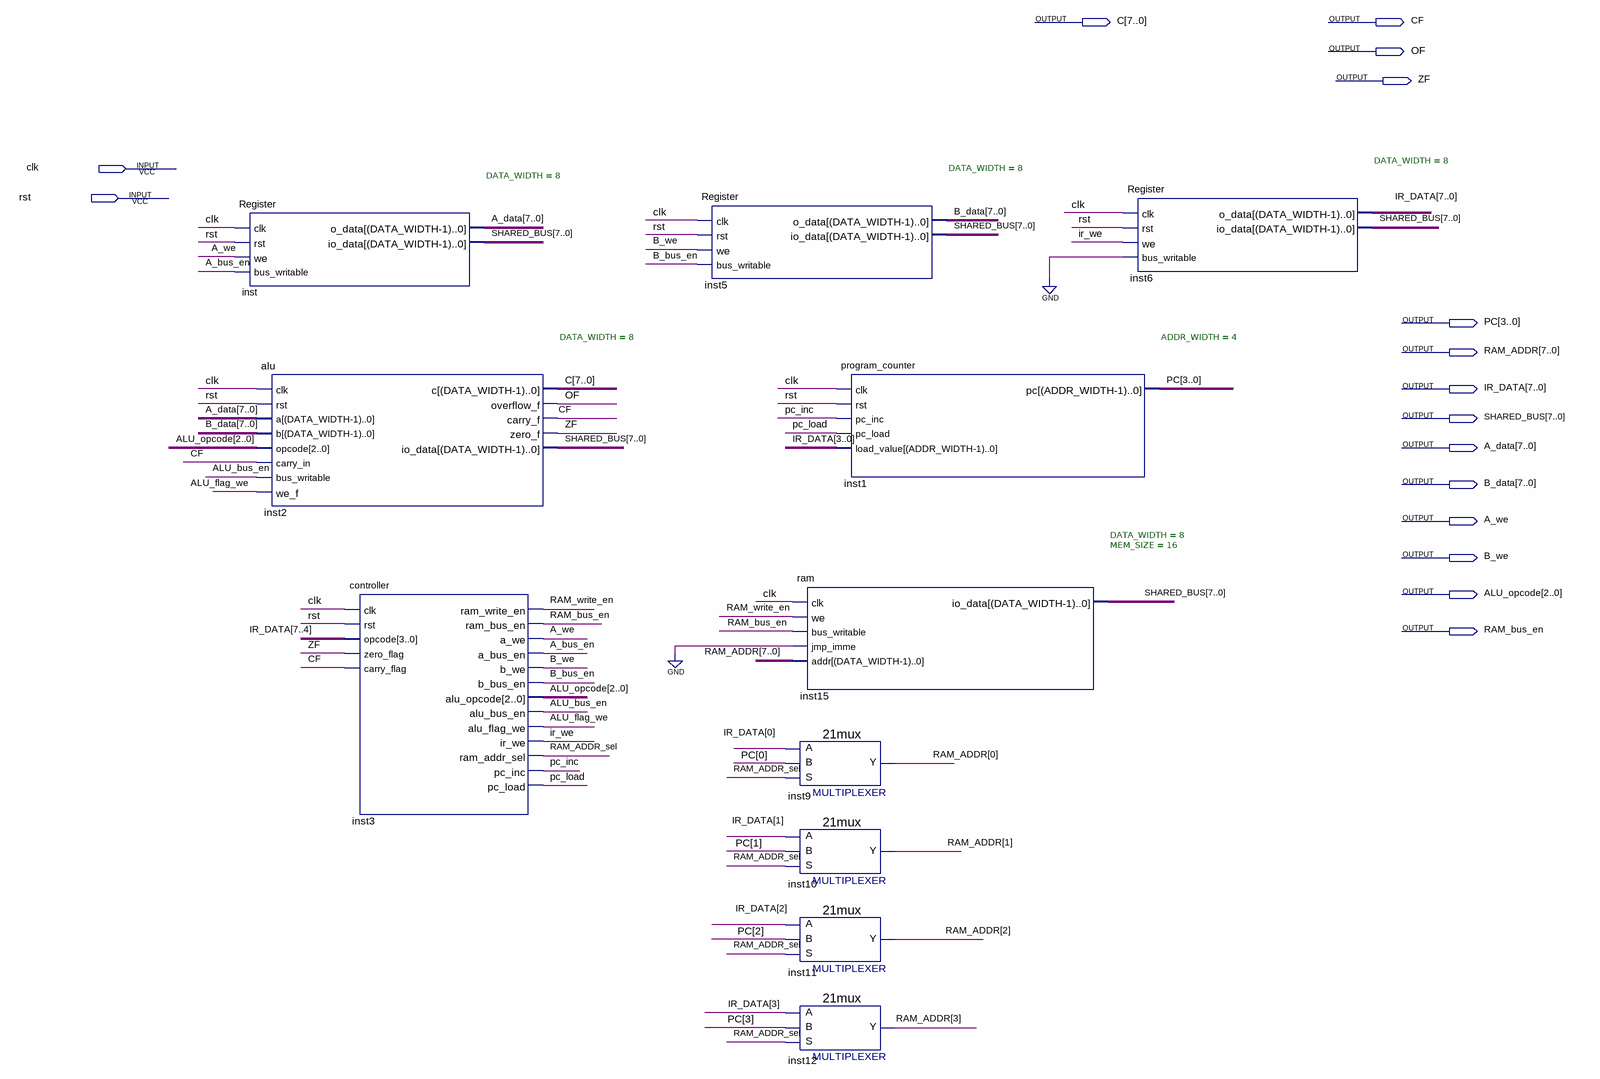
[diagram p0: schematic sheet]
// Quartus schematic cpu_8_bit.bdf as structural Verilog: 11 symbols, 16 pins
module cpu_8_bit (
  input  clk,
  input  rst,
  output [7:0] C,
  output CF,
  output OF,
  output ZF,
  output [3:0] PC,
  output [7:0] RAM_ADDR,
  output [7:0] IR_DATA,
  output [7:0] SHARED_BUS,
  output [7:0] A_data,
  output [7:0] B_data,
  output A_we,
  output B_we,
  output [2:0] ALU_opcode,
  output RAM_bus_en
);

  wire A_bus_en, ALU_bus_en, ALU_flag_we, B_bus_en, ir_we, pc_inc, pc_load, RAM_ADDR_sel, RAM_write_en;

  Register #(.DATA_WIDTH(8)) inst (
    .clk(clk), .rst(rst), .we(A_we), .bus_writable(A_bus_en), .o_data(A_data), .io_data(SHARED_BUS));
  alu #(.DATA_WIDTH(8)) inst2 (
    .clk(clk), .rst(rst), .a(A_data), .b(B_data), .opcode(ALU_opcode), .carry_in(CF),
    .bus_writable(ALU_bus_en), .we_f(ALU_flag_we), .c(C), .overflow_f(OF), .carry_f(CF), .zero_f(ZF),
    .io_data(SHARED_BUS));
  controller inst3 (
    .clk(clk), .rst(rst), .opcode(IR_DATA[7:4]), .zero_flag(ZF), .carry_flag(CF),
    .ram_write_en(RAM_write_en), .ram_bus_en(RAM_bus_en), .a_we(A_we), .a_bus_en(A_bus_en), .b_we(B_we),
    .b_bus_en(B_bus_en), .alu_opcode(ALU_opcode), .alu_bus_en(ALU_bus_en), .alu_flag_we(ALU_flag_we),
    .ir_we(ir_we), .ram_addr_sel(RAM_ADDR_sel), .pc_inc(pc_inc), .pc_load(pc_load));
  Register #(.DATA_WIDTH(8)) inst5 (
    .clk(clk), .rst(rst), .we(B_we), .bus_writable(B_bus_en), .o_data(B_data), .io_data(SHARED_BUS));
  ram #(.DATA_WIDTH(8), .MEM_SIZE(16)) inst15 (
    .clk(clk), .we(RAM_write_en), .bus_writable(RAM_bus_en), .jmp_imme(1'b0), .addr(RAM_ADDR),
    .io_data(SHARED_BUS));
  \21mux  inst9 (.S(RAM_ADDR_sel), .B(PC[0]), .A(IR_DATA[0]), .Y(RAM_ADDR[0]));
  \21mux  inst10 (.S(RAM_ADDR_sel), .B(PC[1]), .A(IR_DATA[1]), .Y(RAM_ADDR[1]));
  \21mux  inst11 (.S(RAM_ADDR_sel), .B(PC[2]), .A(IR_DATA[2]), .Y(RAM_ADDR[2]));
  \21mux  inst12 (.S(RAM_ADDR_sel), .B(PC[3]), .A(IR_DATA[3]), .Y(RAM_ADDR[3]));
  program_counter #(.ADDR_WIDTH(4)) inst1 (
    .clk(clk), .rst(rst), .pc_inc(pc_inc), .pc_load(pc_load), .load_value(IR_DATA[3:0]), .pc(PC));
  Register #(.DATA_WIDTH(8)) inst6 (
    .clk(clk), .rst(rst), .we(ir_we), .bus_writable(1'b0), .o_data(IR_DATA), .io_data(SHARED_BUS));
endmodule
